# Altium project ga2o3-apd-half-bridge.PrjPcb
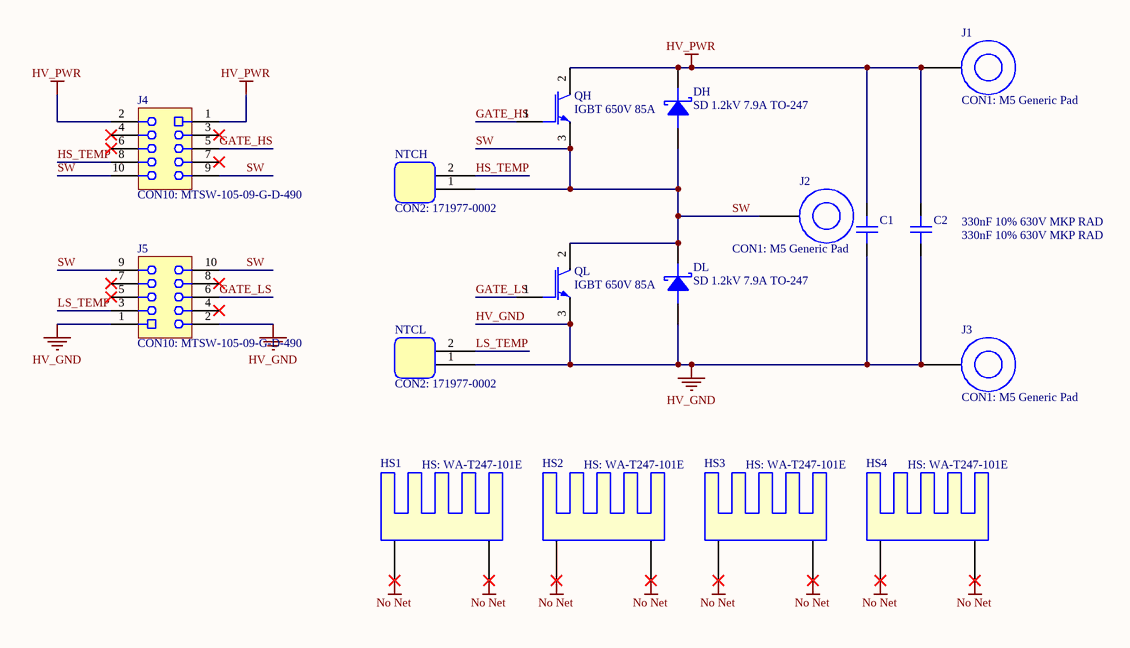
[diagram p0: half-bridge.SchDoc]
1 sheet, 17 parts. Net scope: global (net labels, ports and power ports of the same name join across sheets).
Board file: half-bridge.PcbDoc

## Sheet half-bridge.SchDoc: Half Bridge
size A4; Author: David Redondo; DocumentNumber: 1; SheetNumber: 1; SheetTotal: 1

### Parts
C1  330nF 10% 630V MKP RAD  [330nF 10% 630V MKP RAD-Footprint-1]
C2  330nF 10% 630V MKP RAD  [330nF 10% 630V MKP RAD-Footprint-1]
DH  SD 1.2kV 7.9A TO-247  [SSTO247-3-NCT]
DL  SD 1.2kV 7.9A TO-247  [SSTO247-3-NCT]
HS1  HS: WA-T247-101E  [FP-WA-T247-101E-MFG]
HS2  HS: WA-T247-101E  [FP-WA-T247-101E-MFG]
HS3  HS: WA-T247-101E  [FP-WA-T247-101E-MFG]
HS4  HS: WA-T247-101E  [FP-WA-T247-101E-MFG]
J1  CON1: M5 Generic Pad  [CON1: M5 Generic Pad-Footprint-1]
J2  CON1: M5 Generic Pad  [CON1: M5 Generic Pad-Footprint-1]
J3  CON1: M5 Generic Pad  [CON1: M5 Generic Pad-Footprint-1]
J4  CON10: MTSW-105-09-G-D-490  [MTSW-105-09-G-D-490]
J5  CON10: MTSW-105-09-G-D-490  [MTSW-105-09-G-D-490]
NTCH  CON2: 171977-0002  [CON2: 171977-0002-Footprint-1]
NTCL  CON2: 171977-0002  [CON2: 171977-0002-Footprint-1]
QH  IGBT 650V 85A  [TO247P159X260-3]
QL  IGBT 650V 85A  [TO247P159X260-3]

### Nets
HV_GND: C1.1 C2.1 DL.1(A) J3.1 J5.1 J5.2 NTCL.1 QL.3(EMITTER)
HV_PWR: C1.2 C2.2 DH.2(K) DH.3(K) J1.1 J4.1 J4.2 QH.2(COLLECTOR)
No Net: HS1.1 HS1.2 HS2.1 HS2.2 HS3.1 HS3.2 HS4.1 HS4.2
GATE_HS: J4.5 QH.1(GATE)
GATE_LS: J5.6 QL.1(GATE)
HS_TEMP: J4.8 NTCH.2
LS_TEMP: J5.3 NTCL.2
SW: DH.1(A) DL.2(K) DL.3(K) J2.1 J4.9 J4.10 J5.9 J5.10 NTCH.1 QH.3(EMITTER) QL.2(COLLECTOR)

Not connected (* = marked no-connect by the designer): J4 3* 4* 6* 7*; J5 4* 5* 7* 8*

### Library data of the parts
C1 C2 = CMP-001-00090-2: Film Capacitor, Polypropylene, 630V, 10% +Tol, 10% -Tol, 0.33uF, Through Hole Mount; Manufacturer Part Number: R71PI333050H6K; Ripple Current: 2.06A; ESR (Equivalent Series Resistance): 84mΩ; Voltage Rating (AC): 220V; Width: 6mm; Export Control Classification Number (ECCN) Code: EAR99; Contact Plating: Tin; Max Operating Temperature: 125°C; Voltage Rating (DC): 630V; Min Operating Temperature: -55°C; Number of Terminals: 2; REACH SVHC: Yes; RoHS: Compliant; Length: 18mm; Harmonized Tariff Schedule (HTS) Code: 8532.25.00.70; Height: 12mm; Introduction Date: 2021-07-15; Packaging: Bulk; Case/Package: Radial; Dielectric Material: Polypropylene; Terminal Pitch: 15mm; Value: 330nF; Lifecycle Status: Production
DH DL = CMP-004-00043-4: L-series Gallium Oxide Schottky barrier diode from Novel Crystal Technology; Manufacturer Part Number: NCT-L; Manufacturer: Novel Crystal Technology; Design Item ID: SD 1.2kV 7.9A TO-247; Source: MasterLibrary_SCH.SchLib
HS1-HS4 = CMP-001-00100-3: Heatsink, TEH100 Restr Series, TEH70 Restr Series, TO-247, 11C/W, 43.4X23.4X32MM; Thermal Resistance @ Forced Air Flow (100 LFM): 8°C/W; Natural Thermal Resistance: 11°C/W; Shape: Fins, Rectangular; Introduction Date: 2014-05-09; Color: Black; Type: Passive; Length: 23.1mm; Mounting Technology: Through Hole; Width: 16mm; Country of Origin: Mainland China; RoHS: Compliant; REACH SVHC: Yes; Case/Package: TO-247; Package Cooled: TO-247; Material: Aluminium; Export Control Classification Number (ECCN) Code: EAR99; Weight: 12g; Packaging: Bulk; Height: 30.5mm; Height Off Base: 16.002mm; Lifecycle Status: Production; Harmonized Tariff Schedule (HTS) Code: 8541.90.00.00; Manufacturer Part Number: WA-T247-101E
J1-J3 = CMP-001-00093-2: Generic M5 connector for power or mounting
J4 J5 = CMP-001-00096-1: Pin Header, Board-to-Board, 2.54 mm, 2 Rows, 10 Contacts, Through Hole, MTSW Series; Manufacturer Lifecycle Status: PRODUCTION; Pitch: 2.54mm; Gender: Male; Number of Contacts: 10; Lifecycle Status: Production; Contact Material: Bronze; Mounting Technology: Through Hole; Number of Rows: 2; Packaging: Bulk; Contact Plating: Gold; RoHS: Compliant; Lead Free: Lead Free; Lead Pitch: 2.54mm; Termination: Solder; Radiation Hardening: No
NTCH NTCL = CMP-001-00095-2: 2.54MM Sl Header, Single, Right Angle, Shrouded, Surface Mount, Pegs, 2 Circuits Headers and Wire Housings 0,5527; Manufacturer Lifecycle Status: ACTIVE; Manufacturer: Molex; Plating Thickness: 2.54µm; Number of Circuits: 2; Dielectric Material: Liquid Crystal Polymer; Insulation Resistance: 1GΩ; Current Rating: 3A; Contact Gender: Male; Orientation: Right Angle; Manufacturer Part Number: 171977-0002; Min Operating Temperature: -40°C; Number of Pins: 2; REACH SVHC: Yes; Country of Origin: US; RoHS: Compliant; Schedule B: 8536694040, 8536694040; Category: Headers and Wire Housings; Lifecycle Status: Production; Contact Material: Brass; Number of Rows: 1; Max Operating Temperature: 105°C; Terminal Pitch: 2.54mm; China RoHS: Compliant
QH QL = CMP-309-000000-1: 650V, 85A, TO-247-3 Low VCE(sat) IGBT in TRENCHSTOP 5 technology; Manufacturer: Infineon; Manufacturer Part Number: IGW30N65L5XKSA1; Collector Emitter Saturation Voltage: 1.35V; Switching Frequency: 50Hz; Turn-Off Delay Time: 308ns; Number of Elements: 1; Power Dissipation: 227W; Element Configuration: Single; Max Junction Temperature (Tj): 175°C; Turn-On Delay Time: 33ns; China RoHS: Compliant; Introduction Date: 2014-12-10; Halogen Free: Halogen Free; Max Operating Temperature: 175°C; Case/Package: TO-247; Lifecycle Status: Production; ComponentLink1URL: https://datasheet.octopart.com:443/IGW30N65L5XKSA1-Infineon-datasheet-180062104.pdf?src-supplier=IHS; Collector Emitter Voltage (VCEO): 650V; Collector Emitter Breakdown Voltage: 650V; Number of Terminals: 3; ComponentLink1Description: https://datasheet.octopart.com:443/IGW30N65L5XKSA1-Infineon-datasheet-180062104.pdf?src-supplier=IHS; ComponentLink2Description: https://datasheet.octopart.com:443/IGW30N65L5XKSA1-Infineon-datasheet-62294543.pdf?src-supplier=IHS; Stock: 190; Min Operating Temperature: -40°C; Category: IGBTs; Max Collector Current: 85A; ComponentLink2URL: https://datasheet.octopart.com:443/IGW30N65L5XKSA1-Infineon-datasheet-62294543.pdf?src-supplier=IHS; Pins: 3; Continuous Collector Current: 85A; Mounting Technology: Through Hole; Max Power Dissipation: 227W; Package Quantity: 240; Lead Free: Lead Free; ComponentLink3URL: http://sigma.octopart.com:80/conflict_mineral_statement/Infineon-company-51.pdf?src-supplier=Compliance+Statements; Source: MasterLibrary_SCH.SchLib; REACH SVHC: Yes; Schedule B: 8541290080; Pricing: 5=25,762, 25=21,124, 50=19,582, 125=18,296, 250=16,994 (DKK); Height: 25.5mm; RoHS: Compliant; Export Control Classification Number (ECCN) Code: EAR99; Design Item ID: IGBT 650V 85A; ComponentLink3Description: http://sigma.octopart.com:80/conflict_mineral_statement/Infineon-company-51.pdf?src-supplier=Compliance+Statements